# EAGLE design StepperBreakout (EAGLE 9.1.0)
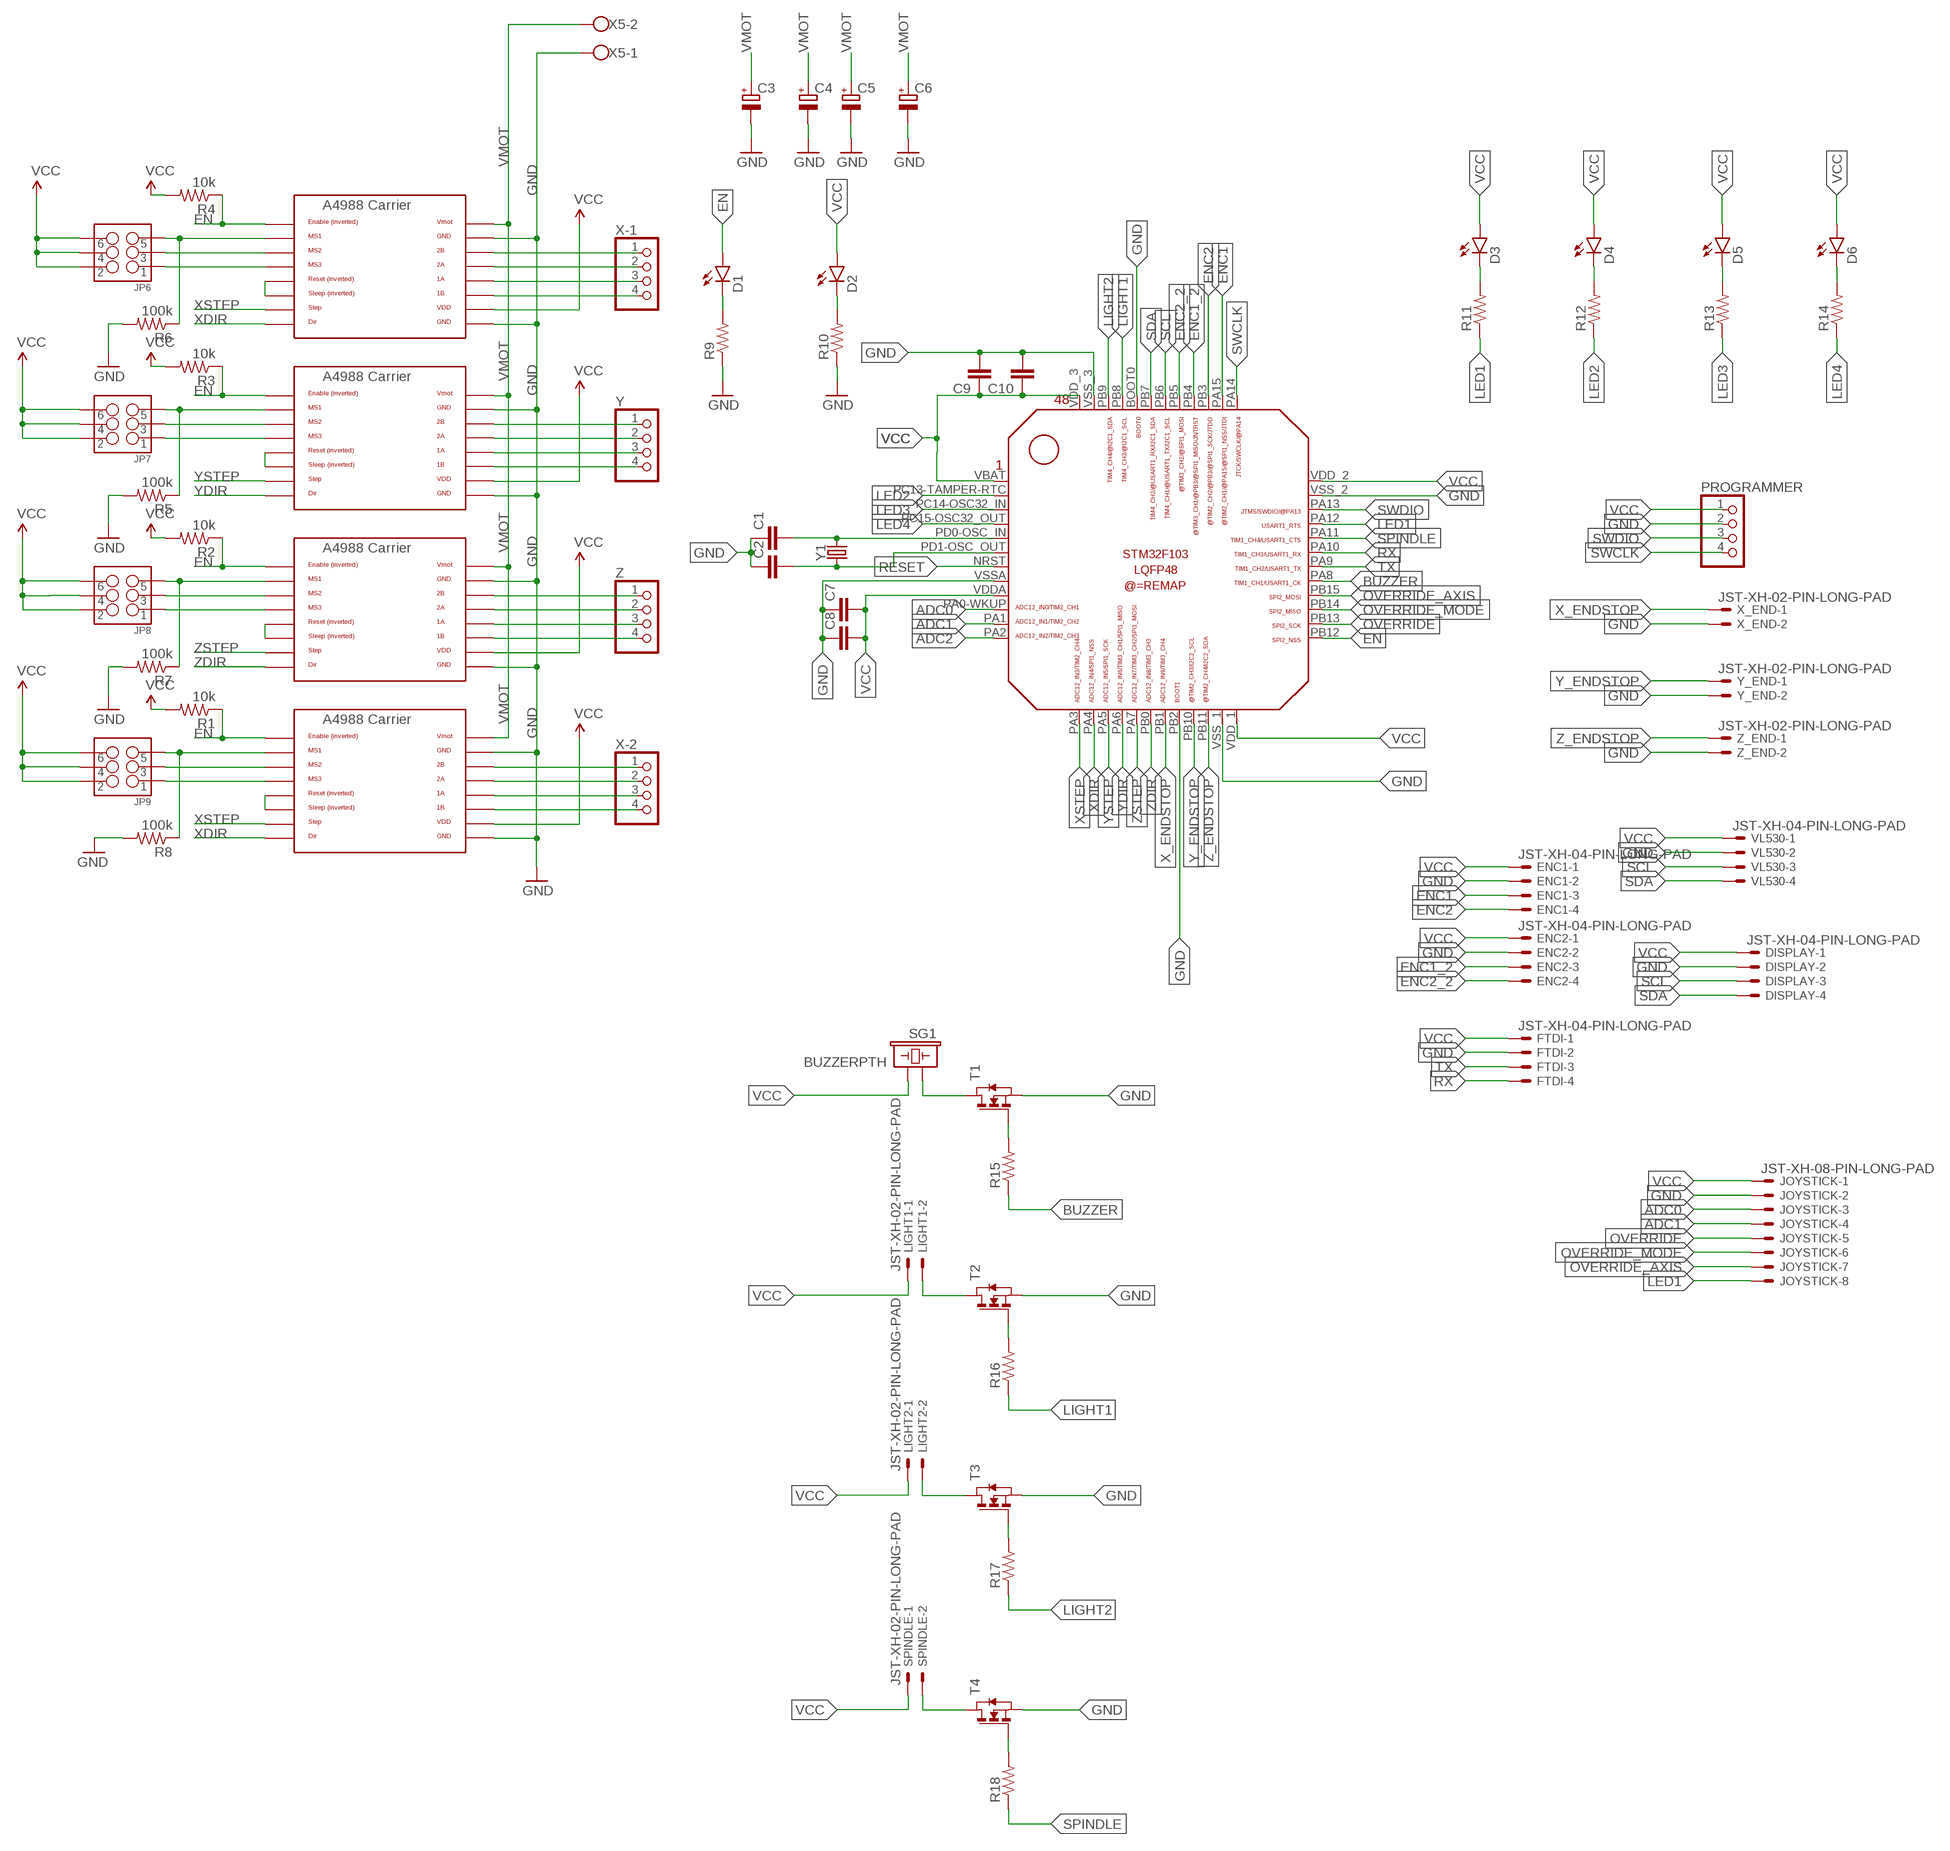
[diagram p0: schematic, sheet 1]

## Parts
C1  C-EUC0805  [C0805]
C2  C-EUC0805  [C0805]
C3  CPOL-EUE5-8.5  [E5-8,5]
C4  CPOL-EUE5-8.5  [E5-8,5]
C5  CPOL-EUE5-8.5  [E5-8,5]
C6  CPOL-EUE5-8.5  [E5-8,5]
C7  C-EUC0805  [C0805]
C8  C-EUC0805  [C0805]
C9  C-EUC0805  [C0805]
C10  C-EUC0805  [C0805]
D1  LED0603  [LED-0603]
D2  LED0603  [LED-0603]
D3  LED0603  [LED-0603]
D4  LED0603  [LED-0603]
D5  LED0603  [LED-0603]
D6  LED0603  [LED-0603]
DISPLAY  JST-XH-04-PIN-LONG-PAD  [JST-XH-04-PACKAGE-LONG-PAD]
ENC1  JST-XH-04-PIN-LONG-PAD  [JST-XH-04-PACKAGE-LONG-PAD]
ENC2  JST-XH-04-PIN-LONG-PAD  [JST-XH-04-PACKAGE-LONG-PAD]
FTDI  JST-XH-04-PIN-LONG-PAD  [JST-XH-04-PACKAGE-LONG-PAD]
JOYSTICK  JST-XH-08-PIN-LONG-PAD  [JST-XH-08-PACKAGE-LONG-PAD]
JP6  M03X2NO_SILK  [2X3-NS]
JP7  M03X2NO_SILK  [2X3-NS]
JP8  M03X2NO_SILK  [2X3-NS]
JP9  M03X2NO_SILK  [2X3-NS]
LIGHT1  JST-XH-02-PIN-LONG-PAD  [JST-XH-02-PACKAGE-LONG-PAD]
LIGHT2  JST-XH-02-PIN-LONG-PAD  [JST-XH-02-PACKAGE-LONG-PAD]
PROGRAMMER  PINHD-1X4  [1X04]
R1  10k  RESISTOR0805-RES  [0805]
R2  10k  RESISTOR0805-RES  [0805]
R3  10k  RESISTOR0805-RES  [0805]
R4  10k  RESISTOR0805-RES  [0805]
R5  100k  RESISTOR0805-RES  [0805]
R6  100k  RESISTOR0805-RES  [0805]
R7  100k  RESISTOR0805-RES  [0805]
R8  100k  RESISTOR0805-RES  [0805]
R9  RESISTOR0805-RES  [0805]
R10  RESISTOR0805-RES  [0805]
R11  RESISTOR0805-RES  [0805]
R12  RESISTOR0805-RES  [0805]
R13  RESISTOR0805-RES  [0805]
R14  RESISTOR0805-RES  [0805]
R15  RESISTOR0805-RES  [0805]
R16  RESISTOR0805-RES  [0805]
R17  RESISTOR0805-RES  [0805]
R18  RESISTOR0805-RES  [0805]
SG1  BUZZERPTH  [BUZZER-12MM]
SPINDLE  JST-XH-02-PIN-LONG-PAD  [JST-XH-02-PACKAGE-LONG-PAD]
T1  NMOSSOT23  [SOT-23]
T2  NMOSSOT23  [SOT-23]
T3  NMOSSOT23  [SOT-23]
T4  NMOSSOT23  [SOT-23]
U$1  POLOLU_A4983CARRIER  [A4988BREAKOUT]
U$2  POLOLU_A4983CARRIER  [A4988BREAKOUT]
U$3  POLOLU_A4983CARRIER  [A4988BREAKOUT]
U$4  POLOLU_A4983CARRIER  [A4988BREAKOUT]
U$5  STM32F103_LQFP48  [STM32F103_LQFP48]
VL530  JST-XH-04-PIN-LONG-PAD  [JST-XH-04-PACKAGE-LONG-PAD]
X5  W237-102  [W237-102]
X-1  PINHD-1X4  [1X04]
X-2  PINHD-1X4  [1X04]
X_END  JST-XH-02-PIN-LONG-PAD  [JST-XH-02-PACKAGE-LONG-PAD]
Y  PINHD-1X4  [1X04]
Y1  CRYSTALPTH-HC49UV  [HC49U]
Y_END  JST-XH-02-PIN-LONG-PAD  [JST-XH-02-PACKAGE-LONG-PAD]
Z  PINHD-1X4  [1X04]
Z_END  JST-XH-02-PIN-LONG-PAD  [JST-XH-02-PACKAGE-LONG-PAD]

## Nets
ADC0: JOYSTICK.3 U$5.PA0-WKUP
ADC1: JOYSTICK.4 U$5.PA1
ADC2: U$5.PA2
BUZZER: R15.1 U$5.PA8
EN: D1.A R1.1 R2.1 R3.1 R4.1 U$1.EN U$2.EN U$3.EN U$4.EN U$5.PB12
ENC1: ENC1.3 U$5.PA15
ENC1_2: ENC2.3 U$5.PB4
ENC2: ENC1.4 U$5.PB3
ENC2_2: ENC2.4 U$5.PB5
GND: C1.1 C2.1 C3.- C4.- C5.- C6.- C7.1 C8.1 C9.2 C10.2 DISPLAY.2 ENC1.2 ENC2.2 FTDI.2 JOYSTICK.2 PROGRAMMER.2 R5.2 R6.2 R7.2 R8.2 R9.1 R10.1 T1.2(S) T2.2(S) T3.2(S) T4.2(S) U$1.GND U$1.GND@0(GND) U$2.GND U$2.GND@0(GND) U$3.GND U$3.GND@0(GND) U$4.GND U$4.GND@0(GND) U$5.BOOT0 U$5.PB2 U$5.VSS_1 U$5.VSS_2 U$5.VSS_3 U$5.VSSA VL530.2 X5.1 X_END.2 Y_END.2 Z_END.2
LED1: JOYSTICK.8 R11.1 U$5.PA12
LED2: R12.1 U$5.PC13-TAMPER-RTC
LED3: R13.1 U$5.PC14-OSC32_IN
LED4: R14.1 U$5.PC15-OSC32_OUT(PC15-OSC_OUT)
LIGHT1: R16.1 U$5.PB8
LIGHT2: R17.1 U$5.PB9
N$1: U$3.1B Y.4
N$2: U$3.1A Y.3
N$3: U$3.2A Y.2
N$4: U$3.2B Y.1
N$5: U$1.2B Z.1
N$6: U$1.2A Z.2
N$7: U$1.1A Z.3
N$8: U$1.1B Z.4
N$9: U$2.2B X-2.1
N$10: U$2.2A X-2.2
N$11: U$2.1A X-2.3
N$12: U$2.1B X-2.4
N$13: U$4.2B X-1.1
N$14: U$4.2A X-1.2
N$15: U$4.1A X-1.3
N$16: U$4.1B X-1.4
N$17: JP6.5 R6.1 U$4.MS1
N$18: JP6.3 U$4.MS2
N$19: JP6.1 U$4.MS3
N$20: JP7.5 R5.1 U$3.MS1
N$21: JP7.3 U$3.MS2
N$22: JP7.1 U$3.MS3
N$23: JP8.5 R7.1 U$1.MS1
N$24: JP8.3 U$1.MS2
N$25: JP8.1 U$1.MS3
N$26: JP9.5 R8.1 U$2.MS1
N$27: JP9.3 U$2.MS2
N$28: JP9.1 U$2.MS3
N$29: C1.2 U$5.PD0-OSC_IN Y1.2
N$30: D1.C R9.2
N$31: D2.C R10.2
N$32: C2.2 U$5.PD1-OSC_OUT Y1.1
N$33: U$2.RST U$2.SLP(SLEEP)
N$34: U$1.RST U$1.SLP(SLEEP)
N$35: U$3.RST U$3.SLP(SLEEP)
N$36: U$4.RST U$4.SLP(SLEEP)
N$37: D3.C R11.2
N$38: D4.C R12.2
N$39: D5.C R13.2
N$40: D6.C R14.2
N$41: SG1.+ T1.1(D)
N$42: R15.2 T1.3(G)
N$44: LIGHT1.2 T2.1(D)
N$45: R16.2 T2.3(G)
N$46: LIGHT2.2 T3.1(D)
N$47: R17.2 T3.3(G)
N$48: SPINDLE.2 T4.1(D)
N$49: R18.2 T4.3(G)
OVERRIDE: JOYSTICK.5 U$5.PB13
OVERRIDE_AXIS: JOYSTICK.7 U$5.PB15
OVERRIDE_MODE: JOYSTICK.6 U$5.PB14
RESET: U$5.NRST
RX: FTDI.4 U$5.PA10
SCL: DISPLAY.3 U$5.PB6 VL530.3
SDA: DISPLAY.4 U$5.PB7 VL530.4
SPINDLE: R18.1 U$5.PA11
SWCLK: PROGRAMMER.4 U$5.PA14
SWDIO: PROGRAMMER.3 U$5.PA13
TX: FTDI.3 U$5.PA9
VCC: C7.2 C8.2 C9.1 C10.1 D2.A D3.A D4.A D5.A D6.A DISPLAY.1 ENC1.1 ENC2.1 FTDI.1 JOYSTICK.1 JP6.2 JP6.4 JP6.6 JP7.2 JP7.4 JP7.6 JP8.2 JP8.4 JP8.6 JP9.2 JP9.4 JP9.6 LIGHT1.1 LIGHT2.1 PROGRAMMER.1 R1.2 R2.2 R3.2 R4.2 SG1.- SPINDLE.1 U$1.VDD U$2.VDD U$3.VDD U$4.VDD U$5.VBAT U$5.VDD_1 U$5.VDD_2 U$5.VDD_3 U$5.VDDA VL530.1
VMOT: C3.+ C4.+ C5.+ C6.+ U$1.VMOT U$2.VMOT U$3.VMOT U$4.VMOT X5.2
X_ENDSTOP: U$5.PB1 X_END.1
XDIR: U$2.DIR U$4.DIR U$5.PA4
XSTEP: U$2.STEP U$4.STEP U$5.PA3
Y_ENDSTOP: U$5.PB10 Y_END.1
YDIR: U$3.DIR U$5.PA6
YSTEP: U$3.STEP U$5.PA5
Z_ENDSTOP: U$5.PB11 Z_END.1
ZDIR: U$1.DIR U$5.PB0
ZSTEP: U$1.STEP U$5.PA7

## Library data of the parts
C1 C2 C7-C10 = rcl:C-EU: CAPACITOR, European symbol; SPICEPREFIX: C
C3-C6 = rcl:CPOL-EU: POLARIZED CAPACITOR, European symbol; SPICEPREFIX: C
D1-D6 = SparkFun-LED:LED: LEDs Standard schematic elements and footprints for 5mm, 3mm, 1206, and 0603 sized LEDs. 5mm - Spark Fun Electronics SKU : COM-00529 (and others)
DISPLAY ENC1 ENC2 FTDI VL530 = Rembrandt Electronics - JST XH Connectors v1-0:JST-XH-04-PIN: JST XH Connector 2 Pin Wire to board connector. Pitch: 2,54 mm, (0.100") Number of pins: 4 Created by Rembrandt Electronics www.rembrandtelectronics.com
JOYSTICK = Rembrandt Electronics - JST XH Connectors v1-0:JST-XH-08-PIN: JST XH Connector 2 Pin Wire to board connector. Pitch: 2,54 mm, (0.100") Number of pins: 8 Created by Rembrandt Electronics www.rembrandtelectronics.com
JP6-JP9 = SparkFun-Connectors:M03X2: 2x3 .1" header. Shrouded, with keying- CONN-10681 SMT- CONN-11415 Pogo pins- HW-11044
LIGHT1 LIGHT2 SPINDLE X_END Y_END Z_END = Rembrandt Electronics - JST XH Connectors v1-0:JST-XH-02-PIN: JST XH Connector 2 Pin Wire to board connector. Pitch: 2,54 mm, (0.100") Number of pins: 2 Created by Rembrandt Electronics www.rembrandtelectronics.com
PROGRAMMER X-1 X-2 Y Z = pinhead:PINHD-1X4: PIN HEADER
R1-R8 = SparkFun-Passives:RESISTOR: Resistor Basic schematic elements and footprints for 0603, 1206, and PTH resistors.
R9-R18 = SparkFun-Resistors:RESISTOR: Resistor Basic schematic elements and footprints for 0603, 1206, and PTH resistors.
SG1 = SparkFun:BUZZER: Buzzer 12mm Spark Fun Electronics SKU : Comp-Buzzer
T1-T4 = zetex:NMOSSOT23: MOS FET; OC_FARNELL: unknown; OC_NEWARK: unknown
U$1-U$4 = RepRapjr:POLOLU_A4983CARRIER
U$5 = STM32F10x F4xx:STM32F103_LQFP48
X5 = con-wago-500:W237-102: WAGO SCREW CLAMP; MPN: 237-102; OC_FARNELL: unknown; OC_NEWARK: 70K9898
Y1 = SparkFun-Clocks:CRYSTAL: Crystals (Generic) These are passive quartz crystals, which can be used as a clock source for a microcontroller. Crystal's are two-terminal devices. They require external "load" capacitors to generate an oscillating signal.

## Board
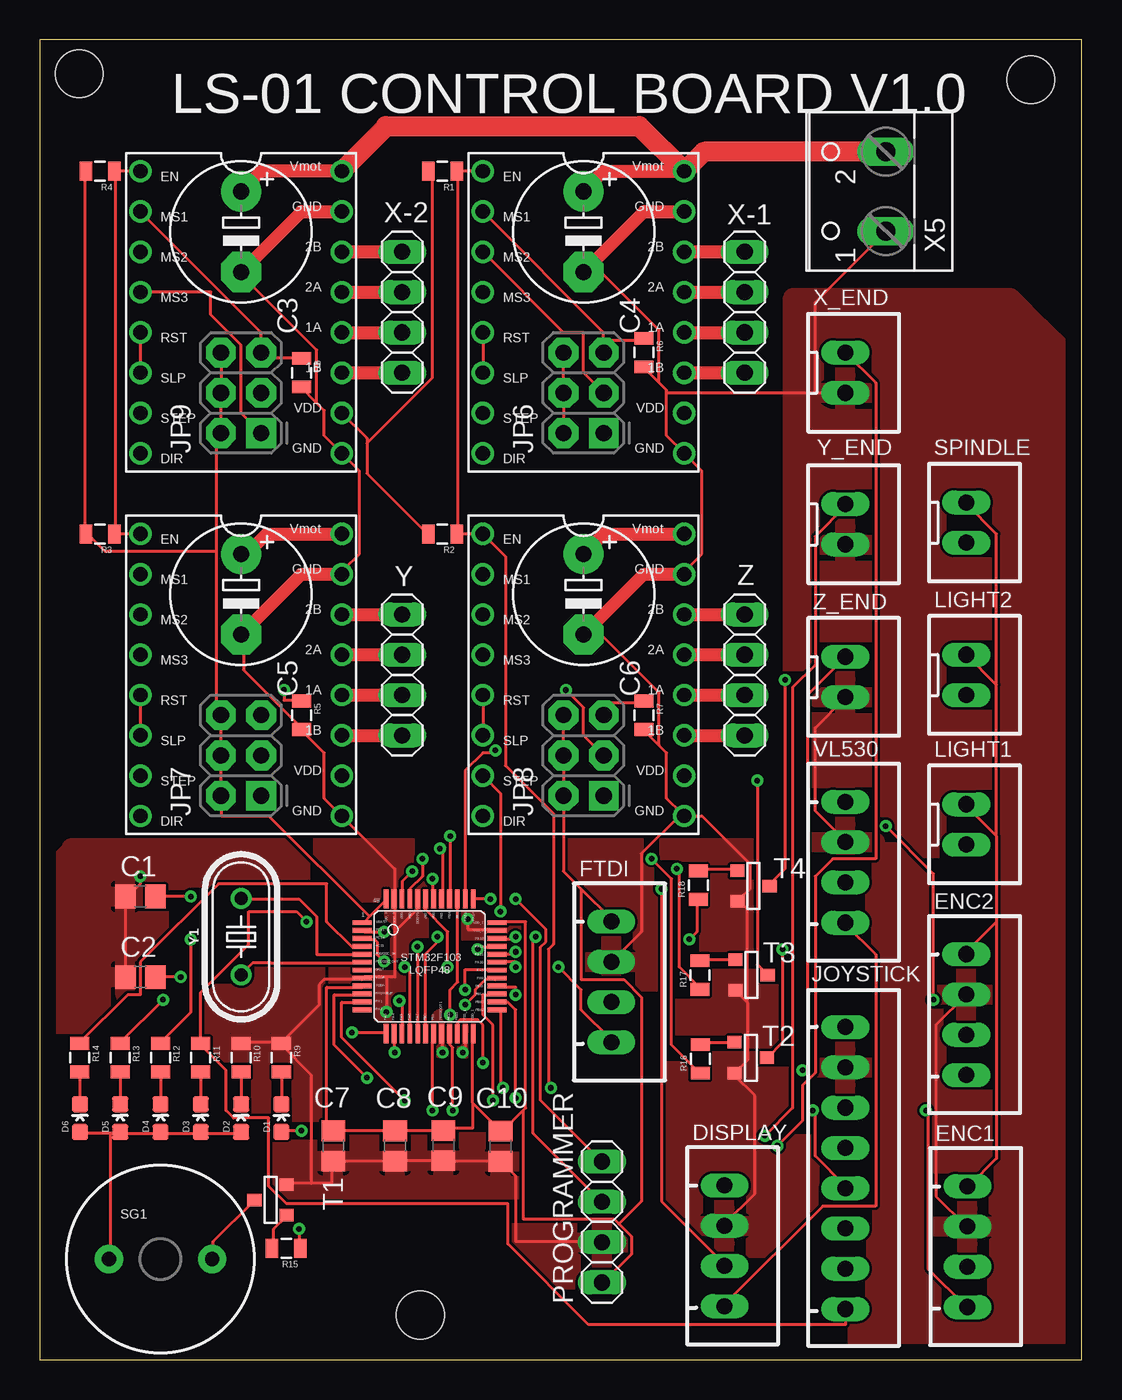
[diagram p1: board, top side]
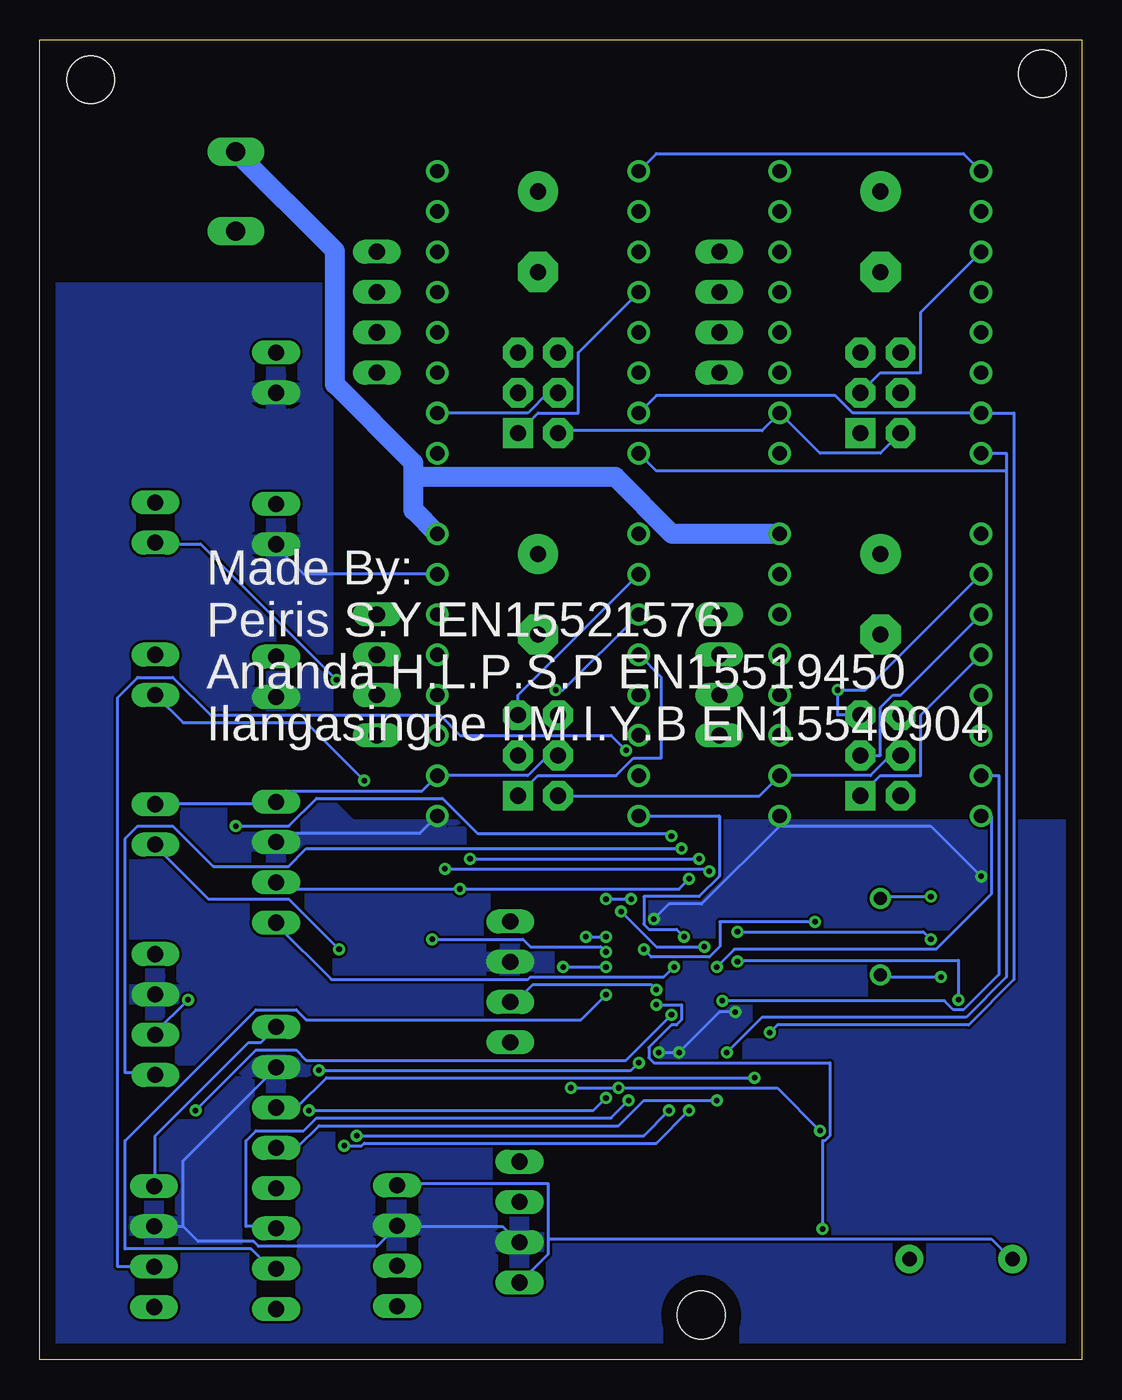
[diagram p2: board, bottom side, seen from below]

Size 65.71 x 83.23 mm. Coordinates in mm from the lower left corner, seen from the top.
Outline: 0,0 65.71,0 65.71,83.23 0,83.23 0,0
Copper layers (1*16): Top 0.035mm / dielectric 1.5mm / Bottom 0.035mm
Design rules "default *": minimum track width 8mil, minimum drill 0.35mm, track to track 6mil, track to pad 6mil, pad to pad 6mil, via to via 6mil, smd to smd 6mil, copper to edge 40mil, drill to drill 6mil, minimum pad ring 10mil, minimum via ring 8mil, stop-mask expansion 4mil, vias tented up to drill 0mil, thermal gap 10mil
Holes 3 mm at 62.48,80.7 2.49,81.08 24,2.82

### Footprints (pad centres in the part's own frame; a part is rotated, then mirrored left to right if it is on the bottom)
C0805 = smd 1.3 x 1.5: 1 -0.95,0; 2 0.95,0
E5-8,5 = drill 1.016 pad 2.54: + -2.54,0 | drill 1.016 pad 2.54 octagon: - 2.54,0
LED-0603 = smd 1 x 1: A 0,-0.877; C 0,0.877
JST-XH-04-PACKAGE-LONG-PAD = drill 1.016 long: 1 -3.81,0; 2 -1.27,0; 3 1.27,0; 4 3.81,0
JST-XH-08-PACKAGE-LONG-PAD = drill 1.016 long: 1 -8.89,0; 2 -6.35,0; 3 -3.81,0; 4 -1.27,0; 5 1.27,0; 6 3.81,0; 7 6.35,0; 8 8.89,0
2X3-NS = drill 1.016 pad 1.88 square: 1 -2.54,-1.27 | drill 1.016 pad 1.88 octagon: 2 -2.54,1.27; 3 0,-1.27; 4 0,1.27; 5 2.54,-1.27; 6 2.54,1.27
JST-XH-02-PACKAGE-LONG-PAD = drill 1.016 long: 1 -1.27,0; 2 1.27,0
1X04 = drill 1.016 long: 1 -3.81,0; 2 -1.27,0; 3 1.27,0; 4 3.81,0
0805 = smd 0.8 x 1.2: 1 -0.9,0; 2 0.9,0
BUZZER-12MM = drill 0.9 pad 1.778: + 3.25,0; - -3.25,0
SOT-23 = smd 0.787 x 0.889: 1 0.025,-1.016; 2 -0.94,1.016; 3 0.991,1.016
A4988BREAKOUT = drill 0.9: 1A 8.89,1.27; 1B 11.43,1.27; 2A 6.35,1.27; 2B 3.81,1.27; DIR 16.51,-11.43; EN -1.27,-11.43; GND 16.51,1.27; GND@0 1.27,1.27; MS1 1.27,-11.43; MS2 3.81,-11.43; MS3 6.35,-11.43; RST 8.89,-11.43; SLP 11.43,-11.43; STEP 13.97,-11.43; VDD 13.97,1.27; VMOT -1.27,1.27
STM32F103_LQFP48 = smd 0.3 x 1.2: BOOT0 -0.75,4.25; PA3 -2.75,-4.25; PA4 -2.25,-4.25; PA5 -1.75,-4.25; PA6 -1.25,-4.25; PA7 -0.75,-4.25; PA14 2.75,4.25; PA15 2.25,4.25; PB0 -0.25,-4.25; PB1 0.25,-4.25; PB2 0.75,-4.25; PB3 1.75,4.25; PB4 1.25,4.25; PB5 0.75,4.25; PB6 0.25,4.25; PB7 -0.25,4.25; PB8 -1.25,4.25; PB9 -1.75,4.25; PB10 1.25,-4.25; PB11 1.75,-4.25; VDD_1 2.75,-4.25; VDD_3 -2.75,4.25; VSS_1 2.25,-4.25; VSS_3 -2.25,4.25 | smd 1.2 x 0.3: NRST -4.25,-0.25; PA0-WKUP -4.25,-1.75; PA1 -4.25,-2.25; PA2 -4.25,-2.75; PA8 4.25,-0.75; PA9 4.25,-0.25; PA10 4.25,0.25; PA11 4.25,0.75; PA12 4.25,1.25; PA13 4.25,1.75; PB12 4.25,-2.75; PB13 4.25,-2.25; PB14 4.25,-1.75; PB15 4.25,-1.25; PC13-TAMPER-RTC -4.25,2.25; PC14-OSC32_IN -4.25,1.75; PC15-OSC32_OUT -4.25,1.25; PD0-OSC_IN -4.25,0.75; PD1-OSC_OUT -4.25,0.25; VBAT -4.25,2.75; VDD_2 4.25,2.75; VDDA -4.25,-1.25; VSS_2 4.25,2.25; VSSA -4.25,-0.75
W237-102 = drill 1.194 long: 1 -2.5,-1.27; 2 2.5,-1.27
HC49U = drill 0.813: 1 -2.413,0; 2 2.413,0

### Placement (x,y rotation side)
C1  6.35,29.21 0 top
C2  6.35,24.13 0 top
C3  12.7,71.12 270 top
C4  34.29,71.12 270 top
C5  12.7,48.26 270 top
C6  34.29,48.26 270 top
C7  18.52,13.49 90 top
C8  22.4,13.49 90 top
C9  25.45,13.51 270 top
C10  29.06,13.46 270 top
D1  15.24,15.24 0 top
D2  12.7,15.24 0 top
D3  10.16,15.24 0 top
D4  7.62,15.24 0 top
D5  5.08,15.24 0 top
D6  2.54,15.24 0 top
DISPLAY  43.18,7.19 270 top
ENC1  58.5,7.14 270 top
ENC2  58.42,21.77 270 top
FTDI  36.04,23.83 270 top
JOYSTICK  50.8,12.09 270 top
JP6  34.29,60.96 90 top
JP7  12.7,38.1 90 top
JP8  34.29,38.1 90 top
JP9  12.7,60.96 90 top
LIGHT1  58.42,33.76 270 top
LIGHT2  58.42,43.18 270 top
PROGRAMMER  35.46,8.69 90 top
R1  25.4,74.93 180 top
R2  25.4,52.07 180 top
R3  3.81,52.07 180 top
R4  3.81,74.93 180 top
R5  16.51,40.64 270 top
R6  38.1,63.5 270 top
R7  38.1,40.64 270 top
R8  16.51,62.23 270 top
R9  15.24,19.05 270 top
R10  12.7,19.05 270 top
R11  10.16,19.05 270 top
R12  7.62,19.05 270 top
R13  5.08,19.05 270 top
R14  2.54,19.05 270 top
R15  15.54,7.04 180 top
R16  41.66,18.97 90 top
R17  41.63,24.26 90 top
R18  41.53,29.92 90 top
SG1  7.62,6.35 0 top
SPINDLE  58.42,52.78 270 top
T1  14.55,10.11 270 top
T2  44.83,19.02 90 top
T3  44.88,24.23 90 top
T4  45.01,29.84 90 top
U$1  39.37,50.8 270 top
U$2  17.78,73.66 270 top
U$3  17.78,50.8 270 top
U$4  39.37,73.66 270 top
U$5  24.59,24.82 0 top
VL530  50.8,31.37 270 top
X5  52.07,73.66 90 top
X-1  44.45,66.04 270 top
X-2  22.86,66.04 270 top
X_END  50.8,62.23 270 top
Y  22.86,43.18 270 top
Y1  12.7,26.67 90 top
Y_END  50.8,52.68 270 top
Z  44.45,43.18 270 top
Z_END  50.8,43.05 270 top

### Tracks (layer width: path | path; a pad name or v marks a point on that pad's centre or on a via)
ADC0  (via drill 0.35)
  Top 0.203: v20.64,17.78 18.57,19.84 18.57,23.02 20.32,23.02 U$5.PA0-WKUP
  Bottom 0.203: v20.64,17.78 47.62,17.78 49.37,16.03 50.8,16.03 JOYSTICK.3
ADC1  (via drill 0.35)
  Top 0.203: v23.02,16.35 19.05,20.32 19.05,22.54 20.32,22.54 U$5.PA1
  Bottom 0.203: v23.02,16.35 27.62,16.35 29.21,14.76 48.1,14.76 49.37,13.49 50.8,13.49 JOYSTICK.4
BUZZER  (via drill 0.35)
  Top 0.203: v16.35,8.26 16.35,7.14 R15.1 | v26.83,22.38 27.46,23.02 27.46,23.34 28.1,23.97 28.73,23.97 U$5.PA8
  Bottom 0.203: v16.35,8.26 16.35,13.81 16.19,13.81 15.88,14.13 15.88,18.73 26.99,18.73 27.3,19.05 27.3,19.68 25.88,21.11 25.56,21.11 25.24,21.43 25.24,22.38 v26.83,22.38
EN  (via drill 0.35)
  Top 0.203: U$3.EN 4.76,52.07 | 4.76,52.07 R3.1 4.76,52.07 | U$2.EN 4.76,74.93 | 4.76,74.93 R4.1 4.76,74.93 | 4.76,74.93 4.76,52.07 | v16.51,14.45 15.24,14.45 D1.A | v29.21,17.14 29.05,17.3 29.05,21.91 28.89,22.07 U$5.PB12 | 26.35,52.07 U$1.EN 29.37,50.64 29.37,37.47 32.38,34.45 32.38,26.19 32.07,25.88 32.07,17.3 v32.23,17.14 | 26.35,52.07 R2.1 26.35,52.07 | U$4.EN 26.35,74.93 | 26.35,74.93 R1.1 26.35,74.93 | 26.35,74.93 26.35,52.07
  Bottom 0.203: v16.51,14.45 19.21,17.14 v29.21,17.14 v32.23,17.14 | U$2.EN 7.46,76.04 26.83,76.04 U$4.EN
ENC1  (via drill 0.35)
  Top 0.203: v28.73,38.42 28.73,38.26 27.94,38.26 26.83,37.15 26.83,29.21 U$5.PA15
  Bottom 0.203: v28.73,38.42 29.69,39.37 39.21,39.37 40.48,40.64 54.93,40.64 57.31,43.02 59.53,43.02 60.8,41.75 60.8,5.87 58.58,5.87 ENC1.3
ENC1_2  (via drill 0.35)
  Top 0.203: v25.88,33.02 25.88,29.21 U$5.PB4 | v53.34,33.66 56.36,30.64 v56.36,22.7
  Bottom 0.203: v25.88,33.02 26.04,33.18 38.1,33.18 40.32,35.4 48.26,35.4 50.01,33.66 v53.34,33.66 | v56.36,22.7 58.42,20.64 ENC2.3
ENC2  (via drill 0.35)
  Top 0.203: v25.88,21.75 25.88,23.34 26.35,23.81 26.35,29.05 U$5.PB3 | v55.88,15.72 56.04,15.56 56.04,5.71 58.42,3.33 ENC1.4
  Bottom 0.203: v25.88,21.75 28.73,18.89 48.9,18.89 49.53,19.53 52.07,19.53 v55.88,15.72
ENC2_2  (via drill 0.35)
  Top 0.203: v25.24,32.23 25.4,32.07 25.4,29.21 U$5.PB5
  Bottom 0.203: v25.24,32.23 48.9,32.23 50.01,31.11 54.77,31.11 57.31,33.66 59.53,33.66 60.33,32.86 60.33,18.1 58.42,18.1 ENC2.4
GND  (via drill 0.35)
  Top 0.203: 39.05,61.59 39.53,61.12 39.53,60.96 | 39.05,61.59 38.1,62.55 R6.2 | 39.53,60.96 39.53,58.26 U$4.GND 41.75,56.04 41.75,50.8 40.8,49.85 U$1.GND@0 | 39.53,60.96 48.9,60.96 | 48.9,60.96 X_END.2 | 48.9,60.96 48.9,66.67 53.34,71.12 X5.1 | 39.05,61.59 39.05,64.93 35.08,68.9 C4.- | 44.61,22.54 44.61,18.89 43.81,18.1 T2.2 43.81,17.94 45.09,16.67 45.09,10.48 43.18,8.57 DISPLAY.2 | 44.61,22.54 43.97,23.18 T3.2 | 44.61,22.54 44.61,28.42 44.13,28.89 T4.2 44.13,29.05 44.77,29.69 44.77,31.27 41.75,34.29 U$1.GND | 39.05,38.73 39.53,38.26 39.53,35.4 40.48,34.45 | 39.05,38.73 38.1,39.69 R7.2 | U$1.GND 40.48,34.45 | 40.48,34.45 37.94,31.91 37.94,26.99 36.2,25.24 FTDI.2 | 40.48,34.45 U$1.GND | Z_END.2 50.8,41.75 48.9,39.85 48.9,34.61 50.8,32.7 VL530.2 | 39.05,38.73 39.05,42.07 35.08,46.04 C6.- | ENC1.2 58.42,8.41 56.52,10.32 56.52,21.11 58.42,23.02 ENC2.2 | 15.24,20 12.7,20 R10.1 | 15.24,20 R9.1 | 17.14,11.11 18.41,11.11 18.41,12.38 C7.1 18.57,12.54 22.38,12.54 C8.1 22.54,12.54 25.4,12.54 C9.2 25.56,12.54 29.05,12.54 C10.2 29.21,12.38 30,11.59 30,7.46 35.4,7.46 PROGRAMMER.2 | 17.14,11.11 15.72,11.11 T1.2 | 17.14,11.11 17.14,17.94 15.24,19.84 R9.1 | v25.4,19.37 25.4,20.48 U$5.PB2 | v26.67,19.37 26.83,19.53 26.83,20.48 U$5.VSS_1 | 21.86,24.13 21.91,24.13 22.38,24.13 22.38,26.99 | 22.38,26.99 22.38,29.05 U$5.VSS_3 22.38,29.21 22.38,30.96 U$3.GND 17.94,35.4 17.94,38.26 16.51,39.69 R5.2 16.51,39.85 12.86,43.5 12.86,45.4 C5.- | 22.38,26.99 23.81,28.42 23.81,29.05 U$5.BOOT0 | 21.86,24.13 v21.86,21.93 | 17.46,60.33 17.94,59.85 17.94,58.26 U$2.GND 20.16,56.04 20.16,50.8 19.21,49.85 U$3.GND@0
  Top 0.203: 17.46,60.33 16.51,61.28 R8.2 | C2.1 C1.1 5.56,29.21 6.35,30 v6.35,30.48 | v26.99,27.78 26.99,27.15 28.73,27.15 U$5.VSS_2 | 17.46,60.33 17.46,63.66 12.86,68.26 C3.- | 15.24,20 17.62,22.38 17.62,23.65 17.94,23.97 20.32,23.97 U$5.VSSA 20.48,24.13 21.86,24.13 | 15.24,20 R9.1
  Top 0.813: C3.- 16.51,72.39 U$2.GND@0 | C4.- 38.1,72.39 U$4.GND@0 | C5.- 16.51,49.53 U$3.GND@0 | C6.- 38.1,49.53 U$1.GND@0
  Bottom 0.203: U$1.GND@0 49.05,49.53 50.8,51.28 Y_END.2 | U$1.GND 41.75,33.18 50.32,33.18 50.8,32.7 VL530.2 | 56.67,8.41 56.67,12.54 50.8,18.41 JOYSTICK.2 | 56.67,8.41 58.42,8.41 ENC1.2 | 43.18,8.41 36.51,8.41 35.56,7.46 PROGRAMMER.2 | 43.18,8.41 DISPLAY.2 43.18,8.41 | 56.67,8.41 55.72,7.46 52.23,7.46 51.91,7.14 44.45,7.14 43.18,8.41 | v26.67,19.37 v25.4,19.37 22.84,21.93 v21.86,21.93 | v26.99,27.78 26.04,28.73 23.97,28.73 19.05,33.66 | 19.05,33.66 U$3.GND 19.05,33.66 | v6.35,30.48 9.53,33.66 19.05,33.66
  pour Top: 2.01,32.26 44.93,32.26 47.17,34.49 47.5,34.82 47.5,66.95 61.19,66.95 63.09,65.05 64.57,63.58 64.57,0.84 1.09,0.84 0.97,0.97 0.97,31.11 1.91,32.05
  pour Bottom: 0.53,33.22 0.74,33.43 46.13,33.43 47.8,35.1 47.8,67.28 65.74,67.28 66.27,66.75 67.34,65.68 67.34,0 0,0 -0.43,0.43 -0.43,32.13 0.53,33.1
LED1  (via drill 0.35)
  Top 0.203: JOYSTICK.8 50.8,3.17 50.8,2.22 34.61,2.22 29.53,7.3 29.53,9.84 15.56,9.84 14.45,10.95 14.45,15.24 12.22,15.24 11.75,15.72 11.75,18.26 10.16,19.84 R11.1 10.16,20 10.16,23.18 13.18,26.19 13.18,28.26 16.19,28.26 v16.83,27.62 | v27.62,25.88 27.62,26.04 28.73,26.04 U$5.PA12
  Bottom 0.203: v27.62,25.88 27.15,25.4 23.5,25.4 22.84,26.06 22.84,27.62 v16.83,27.62
LED2  (via drill 0.35)
  Top 0.203: v9.53,26.51 9.53,21.91 7.62,20 R12.1 | v21.72,26.99 20.48,26.99 U$5.PC13-TAMPER-RTC
  Bottom 0.203: v9.53,26.51 10,26.99 v21.72,26.99
LED3  (via drill 0.35)
  Top 0.203: v7.78,22.7 5.08,20 R13.1 | v21.72,25.11 21.27,25.56 21.27,26.35 21.11,26.51 20.48,26.51 U$5.PC14-OSC32_IN
  Bottom 0.203: v7.78,22.7 7.78,25.19 21.64,25.19 v21.72,25.11
LED4
  Top 0.203: R14.1 2.54,20 5.56,23.02 6.35,23.02 6.35,25.08 11.27,30 18.1,30 18.1,27.62 19.68,26.04 20.32,26.04 U$5.PC15-OSC32_OUT
LIGHT1  (via drill 0.35)
  Top 0.203: v24.13,31.59 24.13,30.48 23.34,29.69 23.34,29.21 U$5.PB8 | v38.58,31.59 39.85,30.32 39.85,19.84 41.59,18.1 R16.1
  Bottom 0.203: v38.58,31.59 v24.13,31.59
LIGHT2  (via drill 0.35)
  Top 0.203: v23.5,30.8 22.86,30.16 22.86,29.21 U$5.PB9 | v40.16,30.96 40.32,30.8 40.32,24.77 41.59,23.5 R17.1
  Bottom 0.203: v23.5,30.8 23.65,30.96 v40.16,30.96
N$1
  Top 0.813: U$3.1B Y.4
N$2
  Top 0.813: U$3.1A Y.3
N$3
  Top 0.813: U$3.2A Y.2
N$4
  Top 0.813: U$3.2B Y.1
N$5
  Top 0.813: U$1.2B Z.1
N$6
  Top 0.813: U$1.2A Z.2
N$7
  Top 0.813: U$1.1A Z.3
N$8
  Top 0.813: U$1.1B Z.4
N$9
  Top 0.813: U$2.2B X-2.1
N$10
  Top 0.813: U$2.2A X-2.2
N$11
  Top 0.813: U$2.1A X-2.3
N$12
  Top 0.813: U$2.1B X-2.4
N$13
  Top 0.813: U$4.2B X-1.1
N$14
  Top 0.813: U$4.2A X-1.2
N$15
  Top 0.813: U$4.1A X-1.3
N$16
  Top 0.813: U$4.1B X-1.4
N$17
  Top 0.203: 35.56,64.29 38.1,64.29 R6.1 | 35.56,64.29 JP6.5 35.56,64.29 | U$4.MS1 35.56,64.77 35.56,64.29
N$18
  Top 0.203: U$4.MS2 33.02,64.77 34.29,64.77 34.29,62.23 JP6.3
N$19
  Bottom 0.203: U$4.MS3 31.75,63.5 31.75,59.69 34.29,59.69 JP6.1
N$20  (via drill 0.35)
  Top 0.203: v15.4,42.23 15.4,41.59 16.51,41.59 R5.1
  Bottom 0.203: JP7.5 15.4,40.64 v15.4,42.23 13.65,42.23 U$3.MS1
N$21
  Bottom 0.203: U$3.MS2 11.43,41.91 11.91,41.91 12.7,41.12 12.7,38.1 JP7.3
N$22
  Bottom 0.203: U$3.MS3 10.16,40.64 10.16,36.83 12.7,36.83 JP7.1
N$23
  Top 0.203: JP8.5 35.56,41.43 38.1,41.43 R7.1
  Bottom 0.203: U$1.MS1 35.56,41.91 JP8.5
N$24  (via drill 0.35)
  Top 0.203: v33.18,42.23 34.29,41.12 34.29,39.37 JP8.3
  Bottom 0.203: U$1.MS2 32.7,42.23 v33.18,42.23
N$25
  Bottom 0.203: U$1.MS3 26.51,43.02 26.51,37.94 28.26,37.94 29.37,36.83 34.29,36.83 JP8.1
N$26
  Top 0.203: R8.1 16.51,63.18 13.97,63.18 JP9.5 13.97,64.77 U$2.MS1
N$27
  Bottom 0.203: U$2.MS2 10.16,66.04 10.16,62.23 12.7,62.23 JP9.3
N$28
  Top 0.203: U$2.MS3 10.79,67.31 10.79,65.88 12.7,63.98 12.7,59.69 JP9.1
N$29  (via drill 0.35)
  Top 0.203: U$5.PD0-OSC_IN 20.32,25.56 17.46,25.56 17.46,27.94 16.35,29.05 12.7,29.05 Y1.2 | v9.53,29.21 C1.2
  Bottom 0.203: v9.53,29.21 12.7,29.21 Y1.2
N$30
  Top 0.203: D1.C 15.24,16.19 15.24,18.1 R9.2
N$31
  Top 0.203: D2.C 12.7,16.19 12.7,18.1 R10.2
N$32  (via drill 0.35)
  Top 0.203: Y1.1 12.7,24.29 13.44,25.03 14.58,25.03 20.3,25.03 U$5.PD1-OSC_OUT | v8.89,24.13 C2.2
  Bottom 0.203: v8.89,24.13 12.7,24.13 Y1.1
N$33
  Top 0.203: U$2.RST U$2.SLP
N$34
  Top 0.203: U$1.RST U$1.SLP
N$35
  Top 0.203: U$3.RST U$3.SLP
N$36
  Top 0.203: U$4.RST U$4.SLP
N$37
  Top 0.203: D3.C 10.16,16.19 10.16,18.1 R11.2
N$38
  Top 0.203: D4.C 7.62,16.19 7.62,18.1 R12.2
N$39
  Top 0.203: D5.C 5.08,16.19 5.08,18.1 R13.2
N$40
  Top 0.203: D6.C 2.54,16.19 2.54,18.1 R14.2
N$41
  Top 0.203: T1.1 13.49,10 10.95,7.46 10.95,6.35 SG1.+
N$42
  Top 0.203: T1.3 15.56,9.05 14.76,8.26 14.76,7.14 R15.2
N$44  (via drill 0.35)
  Top 0.203: v46.83,25.88 46.83,20 45.88,19.05 T2.1
  Bottom 0.203: v46.83,25.88 50.01,29.05 55.09,29.05 58.42,32.38 LIGHT1.2
N$45
  Top 0.203: T2.3 43.81,20 41.75,20 R16.2
N$46  (via drill 0.35)
  Top 0.203: v45.24,36.51 45.24,24.92 45.88,24.29 T3.1
  Bottom 0.203: v45.24,36.51 48.9,40.16 56.67,40.16 LIGHT2.2
N$47
  Top 0.203: T3.3 43.81,25.24 41.75,25.24 R17.2
N$48  (via drill 0.35)
  Top 0.203: v46.99,42.86 46.99,30.96 46.04,30 T4.1
  Bottom 0.203: v46.99,42.86 55.56,51.44 58.42,51.44 SPINDLE.2
N$49
  Top 0.203: T4.3 43.97,30.96 41.59,30.96 R18.2
OVERRIDE  (via drill 0.35)
  Top 0.203: v30,16.51 30,22.07 29.53,22.54 28.89,22.54 U$5.PB13 | v48.74,15.72 48.9,15.56 48.9,12.86 50.8,10.95 JOYSTICK.5
  Bottom 0.203: v30,16.51 30.8,15.72 v48.74,15.72
OVERRIDE_AXIS  (via drill 0.35)
  Top 0.203: v30,23.02 30,23.5 28.89,23.5 U$5.PB15
  Bottom 0.203: v30,23.02 31.59,21.43 48.9,21.43 49.53,22.07 52.07,22.07 60.33,13.81 60.33,6.99 52.39,6.99 51.28,5.87 50.8,5.87 JOYSTICK.7
OVERRIDE_MODE  (via drill 0.35)
  Top 0.203: v28.57,16.35 28.57,21.11 27.94,21.75 27.94,23.02 28.73,23.02 U$5.PB14
  Bottom 0.203: v28.57,16.35 29.69,15.24 48.26,15.24 49.05,14.45 52.07,14.45 52.7,13.81 52.7,8.41 50.8,8.41 JOYSTICK.6
RX  (via drill 0.35)
  Top 0.203: v30,24.77 30,25.08 28.89,25.08 U$5.PA10 | v32.7,24.77 34.13,23.34 34.13,22.07 36.04,20.16 FTDI.4
  Bottom 0.203: v32.7,24.77 v30,24.77
SCL  (via drill 0.35)
  Top 0.203: v24.77,30.32 24.77,29.21 U$5.PB6 | v39.21,29.69 39.21,10 43.18,6.03 DISPLAY.3
  Bottom 0.203: v24.77,30.32 25.4,29.69 v39.21,29.69 50.48,29.69 50.8,30 VL530.3
SDA  (via drill 0.35)
  Top 0.203: v25.72,24.77 25.72,26.99 24.29,28.42 24.29,29.05 U$5.PB7 | DISPLAY.4 43.18,3.49 49.37,9.68 52.7,9.68 52.7,25.56 50.8,27.46 VL530.4
  Bottom 0.203: v25.72,24.77 26.35,24.13 34.77,24.13 34.92,23.97 47.31,23.97 50.8,27.46 VL530.4
SPINDLE  (via drill 0.35)
  Top 0.203: v30,25.72 30,25.56 28.89,25.56 U$5.PA11 | v40.96,26.51 41.43,26.99 41.43,28.89 R18.1
  Bottom 0.203: v30,25.72 30.32,26.04 34.77,26.04 35.24,26.51 v40.96,26.51
SWCLK  (via drill 0.35)
  Top 0.203: v28.42,29.05 27.46,29.05 U$5.PA14 | v30,29.05 31.91,27.15 31.91,26.35 31.59,26.04 31.59,16.35 35.4,12.54 PROGRAMMER.4
  Bottom 0.203: v30,29.05 v28.42,29.05
SWDIO  (via drill 0.35)
  Top 0.203: v30,26.67 30,26.51 28.89,26.51 U$5.PA13 | v31.27,26.67 31.11,26.51 31.11,14.29 35.4,10 PROGRAMMER.3
  Bottom 0.203: v31.27,26.67 v30,26.67
TX  (via drill 0.35)
  Top 0.203: v26.83,23.34 26.83,24.61 28.73,24.61 U$5.PA9
  Bottom 0.203: v26.83,23.34 27.15,23.65 34.61,23.65 35.56,22.7 36.04,22.7 FTDI.3
VCC
  Top 0.203: JP6.2 JP6.4 JP6.6 | 20.64,57.78 20.64,58.1 U$2.VDD | 20.64,57.78 20.64,55.88 24.45,52.07 R2.2 | 20.64,57.78 24.77,61.91 24.77,74.77 24.61,74.93 R1.2 | 20.8,27.94 21.75,28.89 21.75,29.05 U$5.VDD_3 | 20.8,27.94 20.48,27.62 U$5.VBAT | 20.8,27.94 14.45,34.29 11.43,34.29 JP7.2 JP7.4 JP7.6 11.11,40.96 11.11,50.96 | JP9.6 JP9.4 JP9.2 11.11,58.1 11.11,50.96 | 11.11,50.96 4.13,50.96 3.02,52.07 R3.2 2.86,52.07 2.86,74.93 R4.2 | 5.08,14.29 4.45,14.29 | 4.45,14.29 2.54,14.29 D6.A | 5.08,14.29 D5.A 5.08,14.29 | 5.08,14.29 7.62,14.29 | 7.62,14.29 D4.A 7.62,14.29 | 7.62,14.29 10.16,14.29 | 10.16,14.29 D3.A 10.16,14.29 | 10.16,14.29 12.7,14.29 D2.A | 4.45,14.29 4.45,6.35 SG1.- | U$5.VDDA 20.32,23.5 18.1,23.5 18.1,14.76 18.41,14.45 C7.2 18.57,14.45 22.38,14.45 C8.2 22.54,14.45 25.4,14.45 C9.1 25.56,14.61 27.3,14.61 27.3,16.19 | 27.3,16.19 27.3,20.48 U$5.VDD_1 | 27.3,16.19 29.05,14.45 C10.1 29.21,14.45 30.48,15.72 | 30.48,15.72 30.64,15.88 30.64,27.62 28.89,27.62 U$5.VDD_2 | 36.51,8.57 36.2,8.89 30.48,8.89 30.48,15.72 | 36.51,8.57 37.31,7.78 37.31,6.67 35.56,4.92 PROGRAMMER.1 | 34.13,29.69 33.02,30.8 JP8.2 JP8.4 JP8.6 | 34.13,29.69 36.04,27.78 FTDI.1 | 60.33,27.62 58.42,25.72 ENC2.1 | 60.33,33.02 60.33,27.62 | 60.33,33.02 58.42,34.92 LIGHT1.1 | 60.33,42.55 LIGHT2.1 | 60.33,33.02 60.33,42.55 | 60.33,42.55 60.33,52.07 58.42,53.98 SPINDLE.1 | 60.33,27.62 60.33,12.7 58.58,10.95 ENC1.1 | 36.51,8.57 37.94,10 37.94,22.86 36.83,23.97 34.13,23.97 34.13,29.69
  Bottom 0.203: U$4.VDD 34.92,59.69 33.66,60.96 JP6.4 | JP6.2 32.86,58.58 20.16,58.58 U$2.VDD 16.51,57.15 12.7,57.15 JP9.2 | JP7.4 12.06,38.1 13.34,36.83 U$3.VDD 20.32,35.56 JP8.2 | 33.66,7.62 33.66,11.11 43.18,11.11 DISPLAY.1 | 33.66,7.62 33.66,6.67 35.4,4.92 PROGRAMMER.1 | 33.66,7.62 5.71,7.62 4.45,6.35 SG1.- | JP8.4 33.66,38.1 34.92,36.83 U$1.VDD 41.59,35.88 50.16,35.88 50.8,35.24 VL530.1 50.8,35.08 58.42,35.08 LIGHT1.1 | JOYSTICK.1 50.8,20.95 51.75,20 52.55,20 58.42,14.13 58.42,10.95 ENC1.1
VMOT
  Top 0.813: U$2.VMOT 13.97,74.93 C3.+ | C4.+ 35.56,74.93 U$4.VMOT | C5.+ 13.06,50.8 14.33,52.07 U$3.VMOT | C6.+ 35.56,52.07 U$1.VMOT
  Top 1.27: X5.2 41.87,76.16 U$4.VMOT 37.8,77.78 21.82,77.78 21.82,77.7 U$2.VMOT
  Bottom 1.27: X5.2 47.1,69.92 47.1,61.5 42.14,56.54 | U$3.VMOT 25.83,52.07 29.42,55.66 41.79,55.66 42.14,56.01 42.14,56.46 42.14,56.54 | U$1.VMOT 42.14,53.57 42.14,56.54
X_ENDSTOP  (via drill 0.35)
  Top 0.203: v24.77,15.72 24.77,20.48 U$5.PB1 | v46.51,13.49 48.1,15.08 48.1,17.3 48.9,18.1 48.9,30.48 50.01,31.59 52.7,31.59 52.7,61.59 X_END.1
  Bottom 0.203: v24.77,15.72 26.83,13.65 45.24,13.65 45.4,13.49 v46.51,13.49
XDIR  (via drill 0.35)
  Top 0.203: v22.38,19.37 22.38,20.48 U$5.PA4
  Bottom 0.203: v22.38,19.37 20.16,21.59 7.3,21.59 4.76,24.13 4.76,56.04 | 4.76,56.04 4.76,57.15 U$2.DIR | U$4.DIR 26.83,56.04 4.76,56.04
XSTEP  (via drill 0.35)
  Top 0.203: v19.68,20.64 21.75,20.64 U$5.PA3
  Bottom 0.203: v19.68,20.64 19.21,21.11 7.14,21.11 4.29,23.97 4.29,59.69 U$2.STEP 14.45,59.69 15.56,60.8 26.83,60.8 U$4.STEP
Y_ENDSTOP  (via drill 0.35)
  Top 0.203: v26.04,15.72 26.04,19.68 25.88,19.84 25.88,20.48 U$5.PB10 | v45.72,14.13 47.47,15.88 47.47,42.39 48.9,43.81 48.9,51.91 50.8,53.82 Y_END.1
  Bottom 0.203: v26.04,15.72 27.62,14.13 v45.72,14.13
YDIR  (via drill 0.35)
  Top 0.203: v23.02,24.77 23.34,24.45 23.34,20.64 U$5.PA6
  Bottom 0.203: v23.02,24.77 21.91,25.88 9.21,25.88 5.71,29.37 5.71,34.29 U$3.DIR
YSTEP  (via drill 0.35)
  Top 0.203: v22.68,22.64 22.86,22.45 22.86,20.64 U$5.PA5
  Bottom 0.203: v22.68,22.64 8.67,22.64 8.1,22.07 7.46,22.07 5.24,24.29 5.24,36.83 U$3.STEP
Z_ENDSTOP  (via drill 0.35)
  Top 0.203: v27.94,18.73 27.94,21.11 27.62,21.43 26.51,21.43 26.35,21.27 26.35,20.64 U$5.PB11 | v48.1,18.26 48.42,18.57 48.42,41.91 50.8,44.29 Z_END.1
  Bottom 0.203: v27.94,18.73 28.42,18.26 v48.1,18.26
ZDIR  (via drill 0.35)
  Top 0.203: v25.08,26.67 25.08,26.35 24.29,25.56 24.29,20.64 U$5.PB0
  Bottom 0.203: v25.08,26.67 25.56,27.15 27.3,27.15 27.62,27.46 27.62,29.21 24.13,29.21 22.86,30.48 22.86,34.29 U$1.DIR
ZSTEP  (via drill 0.35)
  Top 0.203: v23.81,26.04 23.81,20.64 U$5.PA7 | v29.05,28.26 29.05,35.72 U$1.STEP
  Bottom 0.203: v23.81,26.04 26.83,26.04 v29.05,28.26

### Text on the board
tPlace: LS-01 CONTROL BOARD V1.0
bPlace: Made By: / Peiris S.Y EN15521576 / Ananda H.L.P.S.P EN15519450 / Ilangasinghe I.M.I.Y.B EN15540904